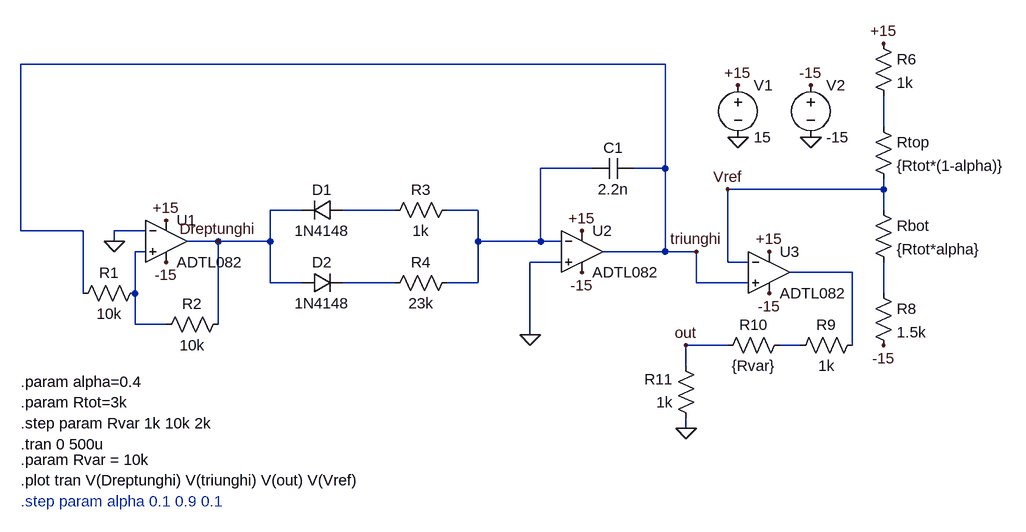
[diagram p0: schematic generatorPWM.asc]
generatorPWM.asc, the LTspice schematic file:
Version 4.1
SHEET 1 1376 680
WIRE 816 -112 -176 -112
WIRE 1152 -16 1152 -64
WIRE 704 48 624 48
WIRE 816 48 816 -112
WIRE 816 48 768 48
WIRE 1152 80 1152 64
WIRE 1152 80 912 80
WIRE 256 112 208 112
WIRE 400 112 320 112
WIRE 528 112 480 112
WIRE 1152 112 1152 80
WIRE -176 144 -176 -112
WIRE -80 144 -176 144
WIRE 16 144 -32 144
WIRE -32 160 -32 144
WIRE 128 160 80 160
WIRE 208 160 208 112
WIRE 208 160 128 160
WIRE 528 160 528 112
WIRE 624 160 624 48
WIRE 624 160 528 160
WIRE 656 160 624 160
WIRE 16 176 0 176
WIRE 816 176 816 48
WIRE 816 176 720 176
WIRE 864 176 816 176
WIRE 656 192 608 192
WIRE 912 192 912 80
WIRE 944 192 912 192
WIRE 1104 208 1008 208
WIRE 208 224 208 160
WIRE 256 224 208 224
WIRE 400 224 320 224
WIRE 528 224 528 160
WIRE 528 224 480 224
WIRE 864 224 864 176
WIRE 944 224 864 224
WIRE -80 240 -80 144
WIRE 0 240 0 176
WIRE 1152 240 1152 192
WIRE 0 288 0 240
WIRE 48 288 0 288
WIRE 128 288 128 160
WIRE 608 304 608 192
WIRE 912 320 848 320
WIRE 1024 320 992 320
WIRE 1104 320 1104 208
WIRE 848 352 848 320
WIRE 848 448 848 432
FLAG 928 0 0
FLAG 1040 0 0
FLAG 928 -80 +15
FLAG 1040 -80 -15
FLAG -32 160 0
FLAG 976 176 +15
FLAG 688 144 +15
FLAG 48 128 +15
FLAG 976 240 -15
FLAG 688 208 -15
FLAG 48 192 -15
FLAG 1152 -144 +15
FLAG 1152 320 -15
FLAG 848 448 0
FLAG 128 160 Dreptunghi
FLAG 864 176 triunghi
FLAG 848 320 out
FLAG 912 80 Vref
FLAG 608 304 0
SYMBOL OpAmps\\ADTL082 48 96 R0
SYMATTR InstName U1
SYMBOL diode 320 96 R90
WINDOW 0 0 32 VBottom 2
WINDOW 3 32 32 VTop 2
SYMATTR InstName D1
SYMATTR Value 1N4148
SYMBOL diode 256 240 R270
WINDOW 0 32 32 VTop 2
WINDOW 3 0 32 VBottom 2
SYMATTR InstName D2
SYMATTR Value 1N4148
SYMBOL res 496 96 R90
WINDOW 0 0 56 VBottom 2
WINDOW 3 32 56 VTop 2
SYMATTR InstName R3
SYMATTR Value 1k
SYMBOL res 496 208 R90
WINDOW 0 0 56 VBottom 2
WINDOW 3 32 56 VTop 2
SYMATTR InstName R4
SYMATTR Value 23k
SYMBOL OpAmps\\ADTL082 688 112 R0
SYMATTR InstName U2
SYMBOL cap 768 32 R90
WINDOW 0 0 32 VBottom 2
WINDOW 3 32 32 VTop 2
SYMATTR InstName C1
SYMATTR Value 2.2n
SYMBOL voltage 928 -96 R0
SYMATTR InstName V1
SYMATTR Value 15
SYMBOL voltage 1040 -96 R0
SYMATTR InstName V2
SYMATTR Value -15
SYMBOL OpAmps\\ADTL082 976 144 R0
SYMATTR InstName U3
SYMBOL res -96 256 R270
WINDOW 0 32 56 VTop 2
WINDOW 3 0 56 VBottom 2
SYMATTR InstName R1
SYMATTR Value 10k
SYMBOL res 32 304 R270
WINDOW 0 32 56 VTop 2
WINDOW 3 0 56 VBottom 2
SYMATTR InstName R2
SYMATTR Value 10k
SYMBOL res 1136 -32 R0
SYMATTR InstName Rtop
SYMATTR Value {Rtot*(1-alpha)}
SYMBOL res 1136 -160 R0
SYMATTR InstName R6
SYMATTR Value 1k
SYMBOL res 1136 96 R0
SYMATTR InstName Rbot
SYMATTR Value {Rtot*alpha}
SYMBOL res 1136 224 R0
SYMATTR InstName R8
SYMATTR Value 1.5k
SYMBOL res 1120 304 R90
WINDOW 0 0 56 VBottom 2
WINDOW 3 32 56 VTop 2
SYMATTR InstName R9
SYMATTR Value 1k
SYMBOL res 1008 304 R90
WINDOW 0 0 56 VBottom 2
WINDOW 3 32 56 VTop 2
SYMATTR InstName R10
SYMATTR Value {Rvar}
SYMBOL res 864 448 R180
WINDOW 0 36 76 Left 2
WINDOW 3 36 40 Left 2
SYMATTR InstName R11
SYMATTR Value 1k
TEXT -176 472 Left 2 !.tran 0 500u
TEXT -176 440 Left 2 !.step param Rvar 1k 10k 2k
TEXT -176 408 Left 2 !.param Rtot=3k
TEXT -176 376 Left 2 !.param alpha=0.4
TEXT -176 496 Left 2 !.param Rvar = 10k
TEXT -176 528 Left 2 !.plot tran V(Dreptunghi) V(triunghi) V(out) V(Vref)
TEXT -176 560 Left 2 ;.step param alpha 0.1 0.9 0.1

The netlist it stands for:
* generatorPWM.asc
X§U1 N004 0 +15 -15 Dreptunghi ADTL082  ; pins In+ In- V+ V- OUT
D1 N003 Dreptunghi 1N4148
D2 Dreptunghi N006 1N4148
R3 N002 N003 1k
R4 N002 N006 23k
X§U2 0 N002 +15 -15 triunghi ADTL082  ; pins In+ In- V+ V- OUT
C1 triunghi N002 2.2n
V1 +15 0 15
V2 -15 0 -15
X§U3 triunghi Vref +15 -15 N005 ADTL082  ; pins In+ In- V+ V- OUT
R1 triunghi N004 10k
R2 N004 Dreptunghi 10k
Rtop N001 Vref {Rtot*(1-alpha)}
R6 +15 N001 1k
Rbot Vref N007 {Rtot*alpha}
R8 N007 -15 1.5k
R9 N005 N008 1k
R10 N008 out {Rvar}
R11 0 out 1k
.model D D
.lib standard.dio
.tran 0 500u
.step param Rvar 1k 10k 2k
.param Rtot=3k
.param alpha=0.4
.param Rvar = 10k
.plot tran V(Dreptunghi) V(triunghi) V(out) V(Vref)
* .step param alpha 0.1 0.9 0.1
.lib ADI.lib
.backanno
.end